# Altium project BananaSchplit-Mini-USBCPD.PrjPcb
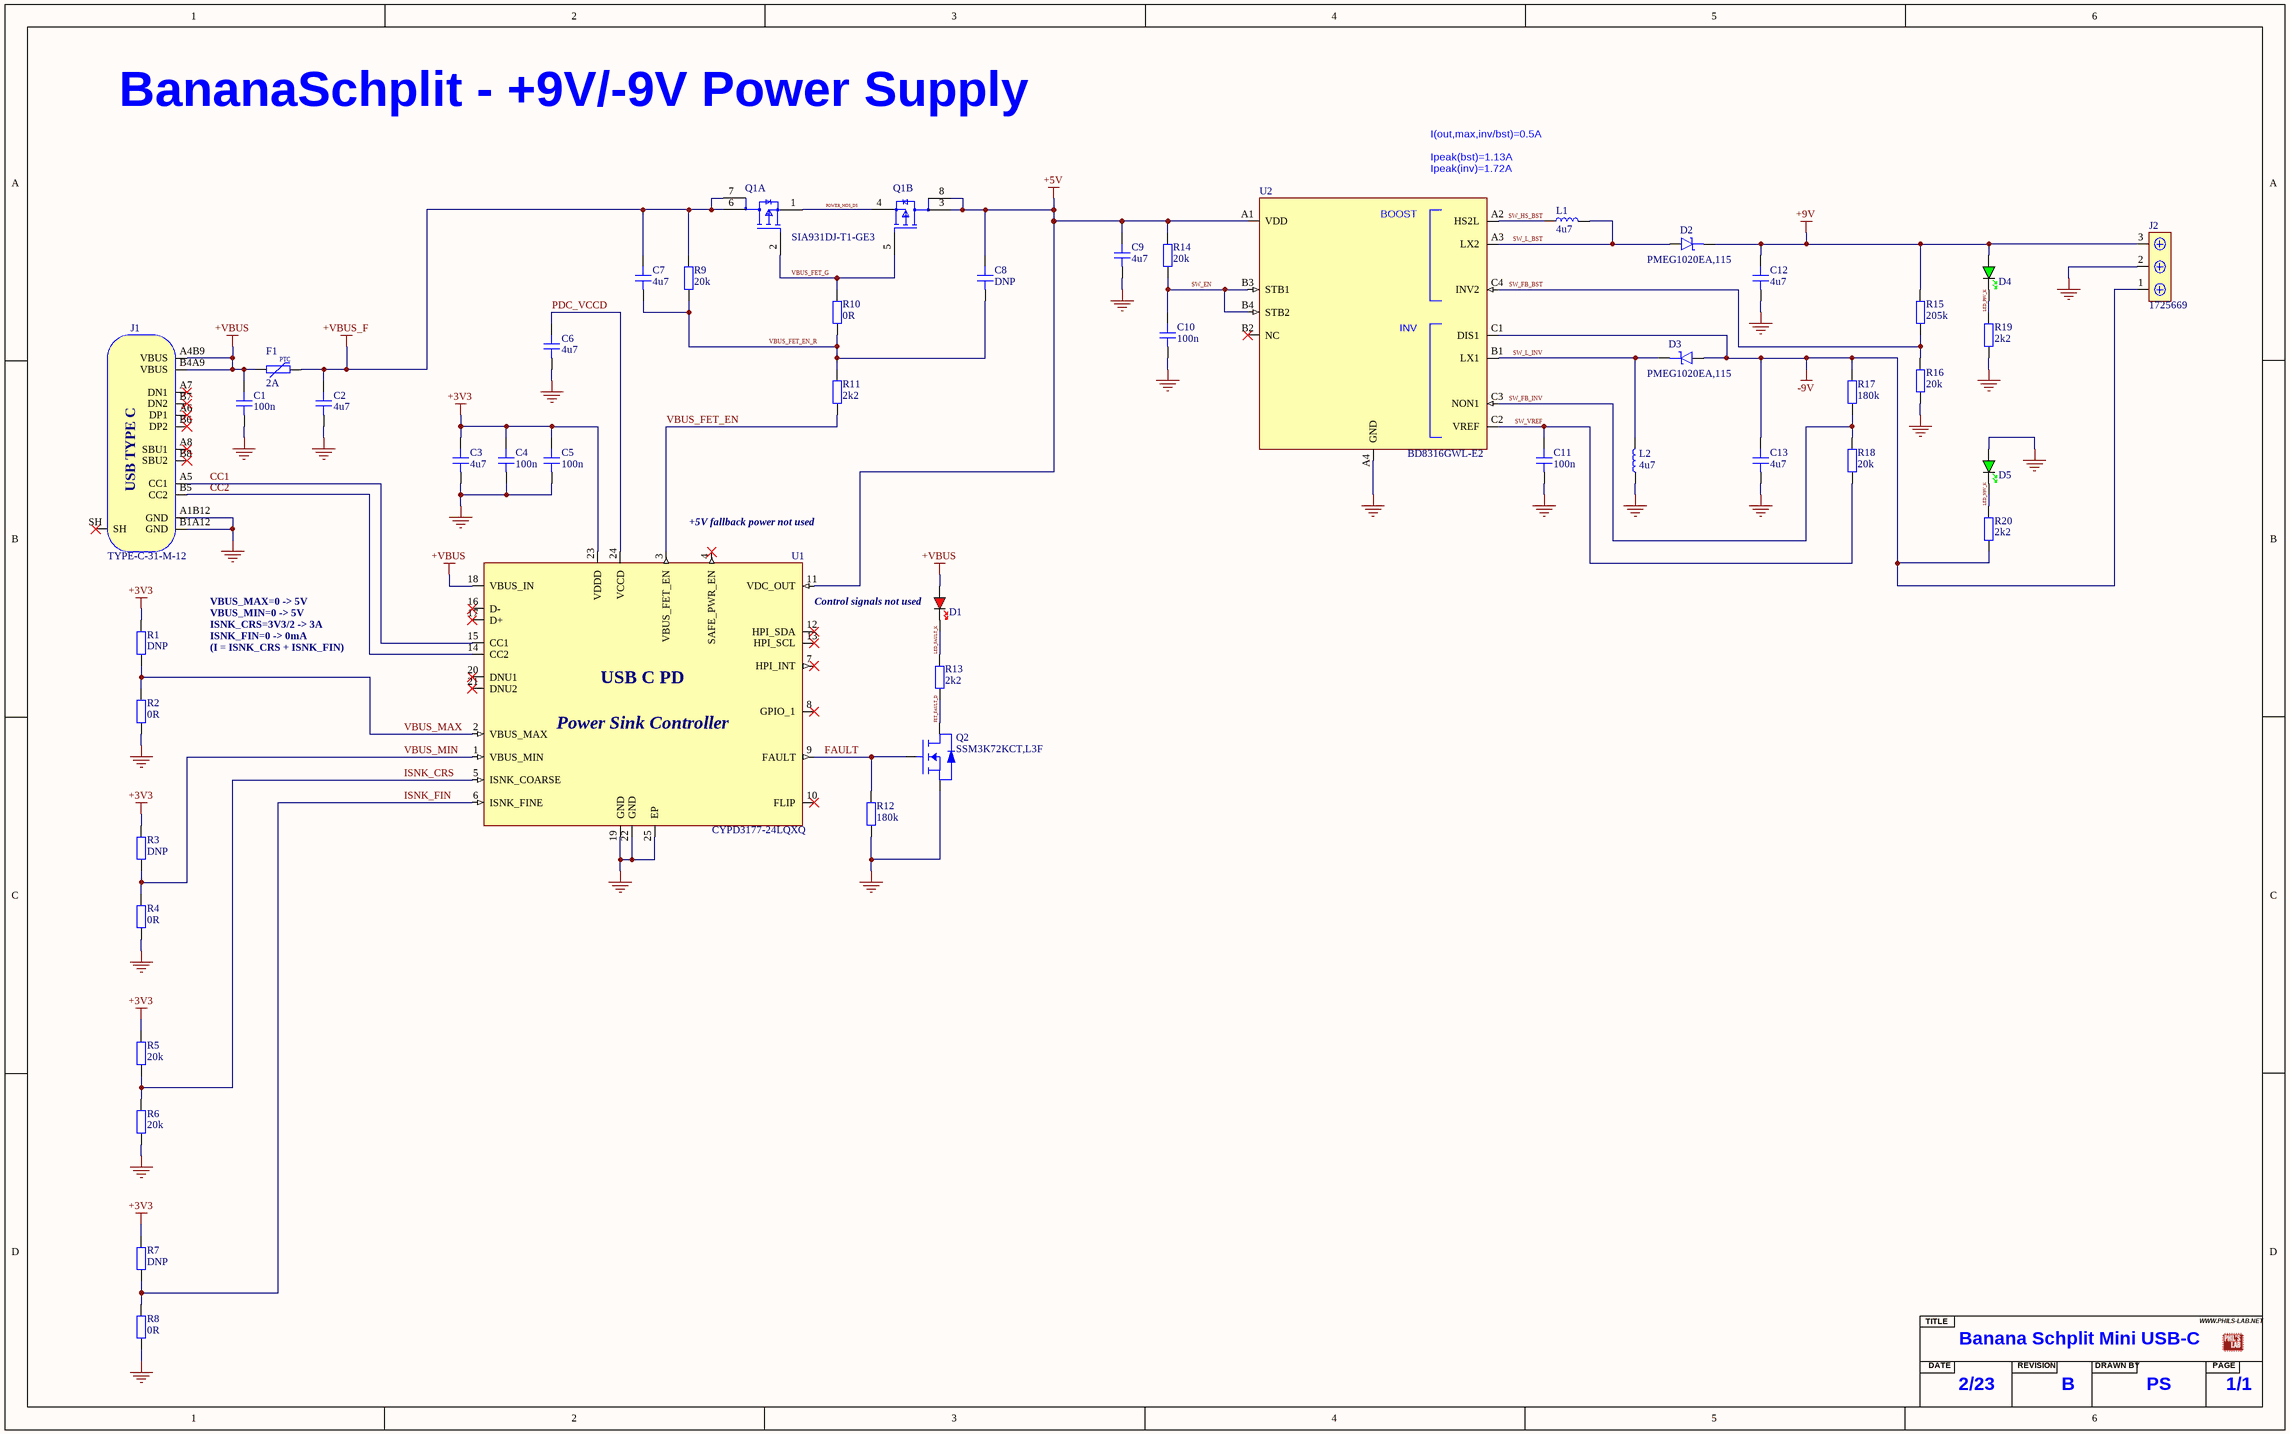
[diagram p0: BananaSchplit-Mini-USBCPD-Schematic.SchDoc]
1 sheet, 48 parts. Net scope: global (net labels, ports and power ports of the same name join across sheets).
Board file: BananaSchplit-Mini-USBCPD-PCB.PcbDoc

## Sheet BananaSchplit-Mini-USBCPD-Schematic.SchDoc
size 508 x 317 mm; SheetNumber: 1; SheetTotal: 1

### Parts
C1  100n  [CAP_0402]
C2  4u7  [CAP_0603]
C3  4u7  [CAP_0603]
C4  100n  [CAP_0402]
C5  100n  [CAP_0402]
C6  4u7  [CAP_0603]
C7  4u7  [CAP_0603]
C8  DNP  [CAP_0402]  (no BOM)
C9  4u7  [CAP_0603]
C10  100n  [CAP_0402]
C11  100n  [CAP_0402]
C12  4u7  [CAP_0603]
C13  4u7  [CAP_0603]
D1  RED  [LED_0402_RED]  (value not drawn)
D2  PMEG1020EA,115  [SOD-323]
D3  PMEG1020EA,115  [SOD-323]
D4  GREEN  [LED_0402_GREEN]  (value not drawn)
D5  GREEN  [LED_0402_GREEN]  (value not drawn)
F1  2A  [FUSE_1206]
J1  TYPE-C-31-M-12  [TYPE-C-31-M-12]
J2  1725669  [1725669]
L1  4u7  [SRP3212A]
L2  4u7  [SRP3212A]
Q1  SIA931DJ-T1-GE3  [FP-C-07431-DUAL-MFG]  (parts A,B of 2)
Q2  SSM3K72KCT,L3F  [CST3-SOT-883]
R1  DNP  [RES_0402]  (no BOM)
R2  0R  [RES_0402]
R3  DNP  [RES_0402]  (no BOM)
R4  0R  [RES_0402]
R5  20k  [RES_0402]
R6  20k  [RES_0402]
R7  DNP  [RES_0402]  (no BOM)
R8  0R  [RES_0402]
R9  20k  [RES_0402]
R10  0R  [RES_0402]
R11  2k2  [RES_0402]
R12  180k  [RES_0402]
R13  2k2  [RES_0402]
R14  20k  [RES_0402]
R15  205k  [RES_0402]
R16  20k  [RES_0402]
R17  180k  [RES_0402]
R18  20k  [RES_0402]
R19  2k2  [RES_0402]
R20  2k2  [RES_0402]
TB  SCHEMATIC_TITLE_BLOCK  (value not drawn)  (graphical)
U1  CYPD3177-24LQXQ  [QFN-24-0MM5]
U2  BD8316GWL-E2  [UCSP50L1]

### Nets
+3V3: C3.2 C4.2 C5.2 R1.2 R3.2 R5.2 R7.2 U1.23(VDDD)
+5V: C8.2 C9.2 Q1.3(D2) Q1.8(D2) R14.2 U1.11(VDC_OUT) U2.A1(VDD)
+9V: C12.2 D2.K D4.A J2.3 R15.2
+VBUS: C1.2 D1.A F1.1 J1.A4B9(VBUS) J1.B4A9(VBUS) U1.18(VBUS_IN)
+VBUS_F: C2.2 C7.2 F1.2 Q1.6(D1) Q1.7(D1) R9.2
-9V: C13.2 D3.A J2.1 R17.2 R20.1 U2.C1(DIS1)
GND: C1.1 C2.1 C3.1 C4.1 C5.1 C6.1 C9.1 C10.1 C11.1 C12.1 C13.1 D5.A J1.A1B12(GND) J1.B1A12(GND) J2.2 L2.1 Q2.S R2.1 R4.1 R6.1 R8.1 R12.1 R16.1 R19.1 U1.19(GND) U1.22(GND) U1.25(EP) U2.A4(GND)
CC1: J1.A5(CC1) U1.15(CC1)
CC2: J1.B5(CC2) U1.14(CC2)
FAULT: Q2.G R12.2 U1.9(FAULT)
FET_FAULT_D: Q2.D R13.1
ISNK_CRS: R5.1 R6.2 U1.5(ISNK_COARSE)
ISNK_FIN: R7.1 R8.2 U1.6(ISNK_FINE)
LED_FAULT_K: D1.K R13.2
LED_N9V_K: D5.K R20.2
LED_P9V_K: D4.K R19.2
PDC_VCCD: C6.2 U1.24(VCCD)
POWER_MOS_DS: Q1.1(S1) Q1.4(S2)
SW_EN: C10.2 R14.1 U2.B3(STB1) U2.B4(STB2)
SW_FB_BST: R15.1 R16.2 U2.C4(INV2)
SW_FB_INV: R17.1 R18.2 U2.C3(NON1)
SW_HS_BST: L1.1 U2.A2(HS2L)
SW_L_BST: D2.A L1.2 U2.A3(LX2)
SW_L_INV: D3.K L2.2 U2.B1(LX1)
SW_VREF: C11.2 R18.1 U2.C2(VREF)
VBUS_FET_EN: R11.1 U1.3(VBUS_FET_EN)
VBUS_FET_EN_R: C7.1 C8.1 R9.1 R10.1 R11.2
VBUS_FET_G: Q1.2(G1) Q1.5(G2) R10.2
VBUS_MAX: R1.1 R2.2 U1.2(VBUS_MAX)
VBUS_MIN: R3.1 R4.2 U1.1(VBUS_MIN)

Not connected (* = marked no-connect by the designer): J1 A6(DP1)* A7(DN1)* A8(SBU1)* B6(DP2)* B7(DN2)* B8(SBU2)* SH*; U1 4(SAFE_PWR_EN)* 7(HPI_INT)* 8(GPIO_1)* 10(FLIP)* 12(HPI_SDA)* 13(HPI_SCL)* 16(D-)* 17(D+)* 20(DNU1)* 21(DNU2)*; U2 B2(NC)*

### Notes on the sheet
- BananaSchplit - +9V/-9V Power Supply
- I(out,max,inv/bst)=0.5A
- Ipeak(inv)=1.72A
- Ipeak(bst)=1.13A
- (near U1) +5V fallback power not used
- VBUS_MAX=0 -> 5V
- VBUS_MIN=0 -> 5V
- ISNK_CRS=3V3/2 -> 3A
- ISNK_FIN=0 -> 0mA
- (I = ISNK_CRS + ISNK_FIN)
- (near D1) Control signals not used
- (near TB) Banana Schplit Mini USB-C
- 2/23
- (near TB) B
- PS
- 1/1
- (in symbol BD8316GWL-E2) BOOST; INV
- (in symbol CYPD3177-24LQXQ) USB C PD; Power Sink Controller
- (in symbol FUSE_PPTC_1206) PTC
- (in symbol SCHEMATIC_TITLE_BLOCK) TITLE; WWW.PHILS-LAB.NET; DATE; REVISION; DRAWN BY; PAGE
- (in symbol TYPE-C-31-M-12) USB TYPE C

### Library data of the parts
C1 C4 C5 C10 C11 = CAP_0402_25V: Capacitor SMD 0402 25V; Manufacturer: Murata; Manufacturer Part Number: GRM155R71H104KE14D; Distributor Link: https://www.mouser.de/ProductDetail/Murata-Electronics/GRM155R71H104KE14D?qs=2UZY3JfgLCy9gG9icKV9Yg%3D%3D
C2 C3 C6 C7 C9 C12 C13 = CAP_0603_25V: Capacitor SMD 0603 25V; Manufacturer: Murata; Manufacturer Part Number: GRT188R61E475ME13D; Distributor Link: https://www.mouser.de/ProductDetail/Murata-Electronics/GRT188R61E475ME13D?qs=sGAEpiMZZMvsSlwiRhF8qquPIBdUMwzgRaX4X%2FWWRln9HlRbg8TjFQ%3D%3D
C8 = CAP_0402_25V: Capacitor SMD 0402 25V
D1 = LED_0402_RED: LED 0402 RED SMD; Manufacturer: Lite-On; Manufacturer Part Number: LTST-C281KRKT; Distributor Link: https://www.mouser.de/ProductDetail/Lite-On/LTST-C281KRKT?qs=xb8aMrBSZRKAPWJcmf%2F7XQ%3D%3D
D2 D3 = D_SCHOTTKY_SOD_323: Diode Schottky SMD SOD-323; Manufacturer: Nexperia; Manufacturer Part Number: PMEG1020EA,115; Distributor Link: https://www.mouser.de/ProductDetail/Nexperia/PMEG1020EA115?qs=LOCUfHb8d9vgI3RbmovPSQ%3D%3D
D4 D5 = LED_0402_GREEN: LED 0402 GREEN SMD; Manufacturer: Lite-On; Manufacturer Part Number: LTST-C281KGKT; Distributor Link: https://www.mouser.de/ProductDetail/Lite-On/LTST-C281KGKT?qs=xb8aMrBSZRJ6%2FVAKgwiAkw%3D%3D
F1 = FUSE_PPTC_1206: Fuse PPTC SMD 1206; Manufacturer: Eaton; Manufacturer Part Number: PTS12066V200; Distributor Link: https://www.mouser.de/ProductDetail/Bussmann-Eaton/PTS12066V200?qs=QmibqUXyDhS%2F0O9QsSQTuw%3D%3D
J1 = TYPE-C-31-M-12: USB Type C Connector Horizontal SMT; Manufacturer: Koren Hroparts; Manufacturer Part Number: TYPE-C-31-M-12; LCSC: C165948; Distributor Link: https://www.lcsc.com/product-detail/USB-Connectors_Korean-Hroparts-Elec-TYPE-C-31-M-12_C165948.html
J2 = 1725669: Screw Terminal Block 3 Positions 2.54mm; Manufacturer: Phoenix; Manufacturer Part Number: 1725669; Distributor Link: https://www.mouser.de/ProductDetail/Phoenix-Contact/1725669?qs=A%2FKWGUWTCZjmkTL0Oe91ew%3D%3D
L1 L2 = SRP3212A-*: Shielded Power Inductor SMD SRP3212A; Manufacturer: Bourns; Manufacturer Part Number: SRP3212A-4R7M; Distributor Link: https://www.mouser.de/ProductDetail/Bourns/SRP3212A-4R7M?qs=t7xnP681wgUDaQ9KSPrZtA%3D%3D
Q1 = CMP-02550-000157-1: MOSFET 2P-CH 30V 4.5A SC70-6L; Manufacturer: Vishay; Number Of P Channels: 2; Turn Off Delay Time: 20ns; Standoff Height: 0mm; Drain To Source Voltage: -30V; Transconductance: 8S; Drain To Source Resistance: 0.052Ω; Threshold Vgs Min: -1.2V; Power Dissipation: 1.9W; Gate To Source Voltage: 20V; Continuous Drain Current: -4.3A; Reverse Recovery Charge: 8nC; Max Junction Temp: +150°C; Pulse Drain Current: -28A; Depletion Mode: False; Gate Charge At Vgs: 8.5nC @ -10V; Rthja Max: 52°C/W; Turn On Delay Time: 8ns; Threshold Vgs Max: -2.2V; Input Capacitace At Vds: 445pF @ -15V; Typ Forward Diode Voltage: -0.9V; Reverse Recovery Time: 15ns; Temperature: -55°C to +150°C; Lead Free: Yes; Automotive: No; Number Of Channels: 2; Manufacturer Part Number: SIA931DJ-T1-GE3; Drain To Source Breakdown Voltage: -30V; Octopart: https://octopart.com/sia931dj-t1-ge3-vishay-46488088; Package: C-07431-DUAL; Height: 0.8mm; Temperature Range Low: -55°C; Device Class L2: Transistors; Device Class L1: Discrete Semiconductors; Max Forward Diode Voltage: -1.2V; Temperature Range High: +150°C; RoHS: TRUE; Device Class L3: MOSFETs; Digikey Description: MOSFET 2P-CH 30V 4.5A SC70-6L; Category: Trans; ComponentLink2URL: http://www.vishay.com/docs/62859/sia931dj.pdf; ComponentLink2Description: Datasheet; Distributor Link: https://www.mouser.de/ProductDetail/Vishay-Semiconductors/SIA931DJ-T1-GE3?qs=c9a7l%2FSwUkL86B%2FuBqErTg%3D%3D
Q2 = SSM3K72KCT,L3F: MOSFET N-Channel Vds=60V Id=400mA Rds(on)=1.05R with ESD Protection; Manufacturer: Toshiba; Manufacturer Part Number: SSM3K72KCT,L3F; Distributor Link: https://www.mouser.de/ProductDetail/Toshiba/SSM3K72KCTL3F?qs=PDgMCp4xDJZBSQ%2Fqg29QOw%3D%3D
R1 R3 R7 = RES_0402: Resistor SMD 0402; Manufacturer: *; Manufacturer Part Number: *; Distributor Link: *
R2 R4 R8 R10 = RES_0402: Resistor SMD 0402; Manufacturer: YAGEO; Manufacturer Part Number: RC0402FR-070RL; Distributor Link: https://www.mouser.de/ProductDetail/YAGEO/RC0402FR-070RL?qs=sxZXDnvRBEhfSy4CZGX2ww%3D%3D
R5 R6 R9 R14 R16 R18 = RES_0402: Resistor SMD 0402; Manufacturer: YAGEO; Manufacturer Part Number: RC0402FR-0720KL; Distributor Link: https://www.mouser.de/ProductDetail/YAGEO/RC0402FR-0720KL?qs=V1yeUXFNrklxRvgYM5JI2A%3D%3D
R11 R13 R19 R20 = RES_0402: Resistor SMD 0402; Manufacturer: YAGEO; Manufacturer Part Number: RC0402FR-072K2L; Distributor Link: https://www.mouser.de/ProductDetail/YAGEO/RC0402FR-072K2L?qs=YUgVZYePFqCtk4LkRUkHoA%3D%3D
R12 R17 = RES_0402: Resistor SMD 0402; Manufacturer: YAGEO; Manufacturer Part Number: RC0402FR-07180KL; Distributor Link: https://www.mouser.de/ProductDetail/YAGEO/RC0402FR-07180KL?qs=V1yeUXFNrkktQqb8%2Fwvwvg%3D%3D
R15 = RES_0402: Resistor SMD 0402; Manufacturer: YAGEO; Manufacturer Part Number: RC0402FR-07205KL; Distributor Link: https://www.mouser.de/ProductDetail/YAGEO/RC0402FR-07205KL?qs=UOUeRUa%252B8WmAlokY7gqvbQ%3D%3D
TB = SCHEMATIC_TITLE_BLOCK: Default Schematic Title Block (Phil's Lab)
U1 = CYPD3177-24LQXQ: USB Type-C Port Controller for Power Sinks; Manufacturer: Cypress Semicon; Manufacturer Part Number: CYPD3177-24LQXQ; Distributor Link: https://www.lcsc.com/product-detail/USB-ICs_Cypress-Semicon-CYPD3177-24LQXQ_C2959321.html; LCSC: C2959321
U2 = BD8316GWL-E2: Step-up and inverted 2-channel DC/DC converter with Built-in Power MOSFET 1.6MHz 1A; Manufacturer: ROHM; Manufacturer Part Number: BD8316GWL-E2; Distributor Link: https://www.mouser.de/ProductDetail/ROHM-Semiconductor/BD8316GWL-E2?qs=9Cg39qEKpi4sbGytSKsU5Q%3D%3D